# Altium project rlink.prjpcb
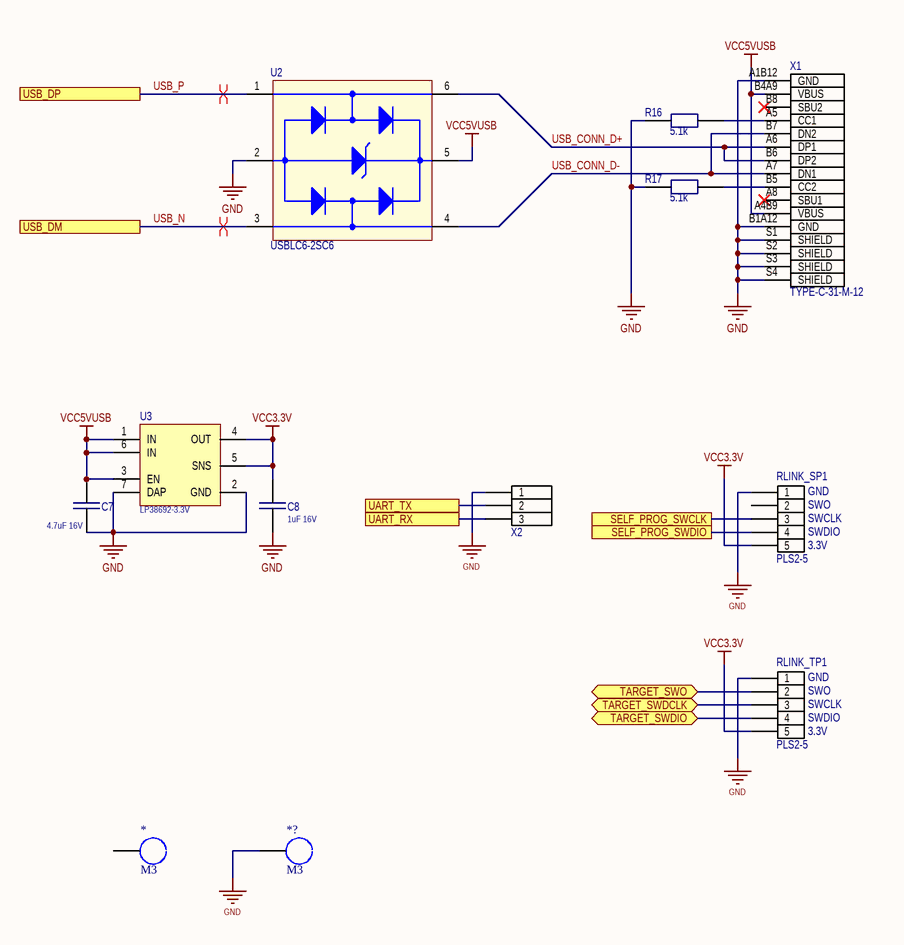
[diagram p0: rlink.schdoc]
2 sheets, 40 parts. Net scope: flat (ports and power ports of the same name join across sheets).
Board file: rlink_pcb.pcbdoc
Sheets:
  rlink.schdoc
  mcu_core.schdoc

## Sheet rlink.schdoc
size 209 x 297 mm

### Parts
*  M3  [M3]
*?  M3  [M3]
C7  4.7uF 16V  [C_0402]
C8  1uF 16V  [C_0402]
R16  5.1k  [R_0402]
R17  5.1k  [R_0402]
RLINK_SP1  PLS2-5  [PLS-5- no 3D  model]
RLINK_TP1  PLS2-5  [PLS-5-3D  right angle]
U2  USBLC6-2SC6  [SOT95P280X145-6N]
U3  LP38692-3.3V  [WSON-6]
X1  TYPE-C-31-M-12  [HRO_TYPE-C-31-M-12]
X2  PLS2-3  [PLS-3- no 3D model]  (value not drawn)

### Ports
SELF_PROG_SWCLK, SELF_PROG_SWDIO, TARGET_SWDCLK (bidir), TARGET_SWDIO (bidir), TARGET_SWO (bidir), UART_RX, UART_TX, USB_DM, USB_DP

### Nets
GND: *?.1 C7.1 C8.1 R16.1 R17.1 RLINK_SP1.1 RLINK_TP1.1 U2.2(GND) U3.2(GND) U3.7(DAP) X1.A1B12(GND) X1.B1A12(GND) X1.S1(SHIELD) X1.S2(SHIELD) X1.S3(SHIELD) X1.S4(SHIELD) X2.1
VCC3.3V: C8.2 RLINK_SP1.5 RLINK_TP1.5 U3.4(OUT) U3.5(SNS)
VCC5VUSB: C7.2 U2.5(VBUS) U3.1(IN) U3.3(EN) U3.6(IN) X1.A4B9(VBUS) X1.B4A9(VBUS)
USB_CONN_D+: U2.6(I/O1_OUT) X1.A6(DP1) X1.B6(DP2)
USB_CONN_D-: U2.4(I/O2_OUT) X1.A7(DN1) X1.B7(DN2)
USB_N: U2.3(I/O2_IN) ; port USB_DM
USB_P: U2.1(I/O1_IN) ; port USB_DP
NetR13_2: RLINK_TP1.3 ; port TARGET_SWDCLK
NetR14_2: RLINK_TP1.4 ; port TARGET_SWDIO
NetR15_2: RLINK_TP1.2 ; port TARGET_SWO
NetR16_2: R16.2 X1.A5(CC1)
NetR17_2: R17.2 X1.B5(CC2)
NetR18_2: X2.2 ; port UART_TX
NetR19_2: X2.3 ; port UART_RX
NetRLINK_SP1_3: RLINK_SP1.3 ; port SELF_PROG_SWCLK
NetRLINK_SP1_4: RLINK_SP1.4 ; port SELF_PROG_SWDIO

Not connected (* = marked no-connect by the designer): * 1; RLINK_SP1 2; X1 A8(SBU1)* B8(SBU2)*

### Layout directives
differential pair: USB_N, USB_P

### Notes on the sheet
- Подп. и дата
- Инв. № дубл.
- Взам. инв. №
- Инв. № подл.
- Лист
- Изм.
- № докум.
- Подп.
- Дата
- (in symbol PLS2-5) GND; SWO; SWCLK; SWDIO; 3.3V

### Library data of the parts
C7 C8 = C0402: Capacitor
R16 R17 = RES_SMD: Resistor; Part Number: RC0402JR-075K1L; Alternative Part: *; Value: 5.1k
RLINK_SP1 RLINK_TP1 = PLS2-5: Header, 5-Pin; LatestRevisionDate: 17-Jul-2002; LatestRevisionNote: Re-released for DXP Platform.; Publisher: Altium Limited
U2 = USBLC6-2SC6: 17V Clamp 5A (8/20Âµs) Ipp Tvs Diode Surface Mount SOT-23-6; MF: STMicroelectronics; Value: *; Check_prices: https://www.snapeda.com/parts/USBLC6-2SC6/STMicroelectronics/view-part/?ref=eda; MP: USBLC6-2SC6; Purchase-URL: https://pricing.snapeda.com/search/part/USBLC6-2SC6/?ref=eda; Price: None; Availability: In Stock; Package: SOT-23-6 STMicroelectronics; SnapEDA_Link: https://www.snapeda.com/parts/USBLC6-2SC6/STMicroelectronics/view-part/?ref=snap; Part Number: USBLC6-2SC6; Alternative Part: *
U3 = LP38692: LP38690, LP38692 1-A LDO CMOS Linear Regulators  Stable with Ceramic Output Capacitors
X1 = TYPE-C-31-M-12: USB Connectors 24 Receptacle 1 8.94*7.3mm RoHS; Package: None; Availability: Unavailable; Value: *; MP: TYPE-C-31-M-12; Price: None; Part Number: TYPE-C-31-M-12; Alternative Part: *
X2 = PLS2-3: Header, 3-Pin; LatestRevisionDate: 17-Jul-2002; LatestRevisionNote: Re-released for DXP Platform.; Publisher: Altium Limited

## Sheet mcu_core.schdoc
size 209 x 297 mm
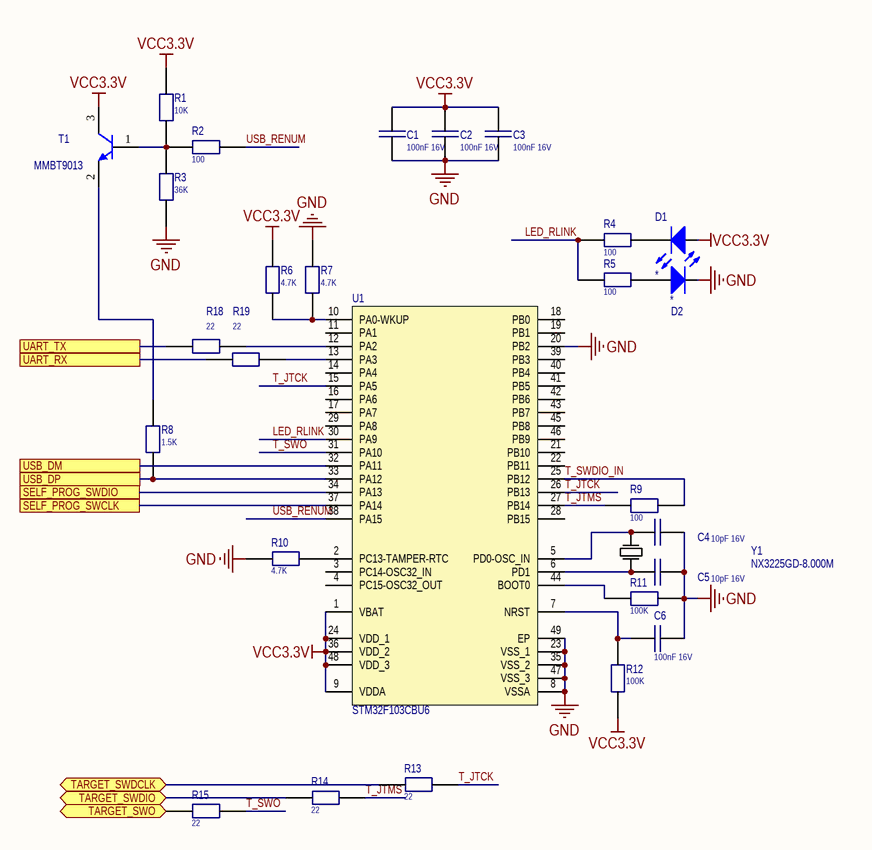
[diagram p1: mcu_core.schdoc]

### Parts
C1  100nF 16V  [C_0402]
C2  100nF 16V  [C_0402]
C3  100nF 16V  [C_0402]
C4  10pF 16V  [C_0402]
C5  10pF 16V  [C_0402]
C6  100nF 16V  [C_0402]
D1  *  [LED_1206]
D2  *  [LED_1206]
R1  10K  [R_0402]
R2  100  [R_0402]
R3  36K  [R_0402]
R4  100  [R_0402]
R5  100  [R_0402]
R6  4.7K  [R_0402]
R7  4.7K  [R_0402]
R8  1.5K  [R_0402]
R9  100  [R_0402]
R10  4.7K  [R_0402]
R11  100K  [R_0402]
R12  100K  [R_0402]
R13  22  [R_0402]
R14  22  [R_0402]
R15  22  [R_0402]
R18  22  [R_0402]
R19  22  [R_0402]
T1  MMBT9013  [SOT23]
U1  STM32F103CBU6  [STM-UFQFPN48_M]
Y1  NX3225GD-8.000M  [NX3225GD]

### Ports
SELF_PROG_SWCLK, SELF_PROG_SWDIO, TARGET_SWDCLK (bidir), TARGET_SWDIO (bidir), TARGET_SWO (bidir), UART_RX, UART_TX, USB_DM, USB_DP

### Nets
GND: C1.1 C2.1 C3.1 C4.1 C5.1 C6.1 D2.2(K) R3.2 R7.2 R10.2 R11.1 U1.8(VSSA) U1.20(PB2) U1.23(VSS_1) U1.35(VSS_2) U1.47(VSS_3) U1.49(EP)
VCC3.3V: C1.2 C2.2 C3.2 D1.1(A) R1.2 R6.2 R12.2 T1.3(C) U1.1(VBAT) U1.9(VDDA) U1.24(VDD_1) U1.36(VDD_2) U1.48(VDD_3)
LED_RLINK: R4.2 R5.2 U1.30(PA9)
T_JTCK: R13.1 U1.15(PA5) U1.26(PB13)
T_JTMS: R9.2 R14.1 U1.27(PB14)
T_SWDIO_IN: R9.1 U1.25(PB12)
T_SWO: R15.1 U1.31(PA10)
USB_N: U1.32(PA11) ; port USB_DM
USB_P: R8.1 U1.33(PA12) ; port USB_DP
USB_RENUM: R2.1 U1.38(PA15)
NetC4_2: C4.2 U1.5(PD0-OSC_IN) Y1.2(OSC2)
NetC5_2: C5.2 U1.6(PD1) Y1.1(OSC1)
NetC6_2: C6.2 R12.1 U1.7(NRST)
NetD1_2: D1.2(K) R4.1
NetD2_1: D2.1(A) R5.1
NetR1_1: R1.1 R2.2 R3.1 T1.1(B)
NetR6_1: R6.1 R7.1 U1.10(PA0-WKUP)
NetR8_2: R8.2 T1.2(E)
NetR10_1: R10.1 U1.2(PC13-TAMPER-RTC)
NetR11_2: R11.2 U1.44(BOOT0)
NetR13_2: R13.2 ; port TARGET_SWDCLK
NetR14_2: R14.2 ; port TARGET_SWDIO
NetR15_2: R15.2 ; port TARGET_SWO
NetR18_1: R18.1 U1.12(PA2)
NetR18_2: R18.2 ; port UART_TX
NetR19_1: R19.1 U1.13(PA3)
NetR19_2: R19.2 ; port UART_RX
NetRLINK_SP1_3: U1.37(PA14) ; port SELF_PROG_SWCLK
NetRLINK_SP1_4: U1.34(PA13) ; port SELF_PROG_SWDIO

Not connected (* = marked no-connect by the designer): U1 3(PC14-OSC32_IN) 4(PC15-OSC32_OUT) 11(PA1) 14(PA4) 16(PA6) 17(PA7) 18(PB0) 19(PB1) 21(PB10) 22(PB11) 28(PB15) 29(PA8) 39(PB3) 40(PB4) 41(PB5) 42(PB6) 43(PB7) 45(PB8) 46(PB9)

### Notes on the sheet
- Подп. и дата
- Инв. № дубл.
- Взам. инв. №
- Инв. № подл.
- Лист
- Изм.
- № докум.
- Подп.
- Дата

### Library data of the parts
C1-C6 = C0402: Capacitor
D1 D2 = LED_SMT_1206: Typical INFRARED GaAs LED; Value: *; Color: *
R1-R15 R18 R19 = R0402: Resistor
  R1: Value: 10K
  R2 R4 R5 R9: Value: 100
  R3: Value: 36K
  R6 R7 R10: Value: 4.7K
  R8: Value: 1.5K
  R11 R12: Value: 100K
  R13-R15 R18 R19: Value: 22
T1 = NPN: NPN Bipolar Transistor; Code - JEDEC: TO-226-AA; Published: 8-Jun-2000; Revision: July-2002: Re-released for DXP Platform.; Publisher: Altium Limited
U1 = STM32F103CBU6: STM32 ARM-based 32-bit MCU Performance Line with 128 kB Flash, 20 kB Internal RAM, -40 to +85°C Temperature, 48-Pin VFQFPN, Tray; DatasheetVersion: rev13.0, Apr-2011; PackageVersion: 2011; PackageReference: VFQFPN48; PackageDescription: 48-Pin Quad Flat No-Lead, 7 x 7 x 0.9 mm Body, 0.5 mm Pitch, Exposed Pad; ComponentLink1Description: Manufacturer URL; ComponentLink1URL: http://www.st.com/; ComponentLink2Description: STM32F103 Datasheet; ComponentLink2URL: http://www.st.com/internet/com/TECHNICAL_RESOURCES/TECHNICAL_LITERATURE/DATASHEET/CD00161566.pdf; ComponentLink3Description: STM32 Family Web Page; ComponentLink3URL: www.st.com/stm32
Y1 = NX3225GD: Crystal Oscillator

## Nets that join several sheets
GND: rlink (17 pins), mcu_core (17 pins)
VCC3.3V: rlink (5 pins), mcu_core (13 pins)
NetR13_2: rlink (RLINK_TP1.3), mcu_core (R13.2)
NetR14_2: rlink (RLINK_TP1.4), mcu_core (R14.2)
NetR15_2: rlink (RLINK_TP1.2), mcu_core (R15.2)
NetR18_2: rlink (X2.2), mcu_core (R18.2)
NetR19_2: rlink (X2.3), mcu_core (R19.2)
NetRLINK_SP1_3: rlink (RLINK_SP1.3), mcu_core (U1.37)
NetRLINK_SP1_4: rlink (RLINK_SP1.4), mcu_core (U1.34)
USB_N: rlink (U2.3), mcu_core (U1.32)
USB_P: rlink (U2.1), mcu_core (R8.1 U1.33)